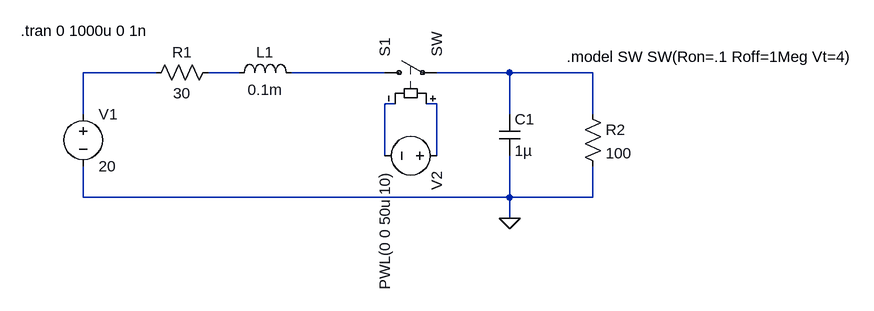
[diagram p0: schematic Draft2.asc]
Draft2.asc, the LTspice schematic file:
Version 4
SHEET 1 1232 680
WIRE 48 48 -64 48
WIRE 176 48 128 48
WIRE 400 48 256 48
WIRE 592 48 480 48
WIRE 720 48 592 48
WIRE 416 96 400 96
WIRE 480 96 464 96
WIRE -64 112 -64 48
WIRE 592 112 592 48
WIRE 720 112 720 48
WIRE 400 176 400 96
WIRE 480 176 480 96
WIRE -64 240 -64 192
WIRE 592 240 592 176
WIRE 592 240 -64 240
WIRE 720 240 720 192
WIRE 720 240 592 240
WIRE 592 272 592 240
FLAG 592 272 0
SYMBOL cap 576 112 R0
SYMATTR InstName C1
SYMATTR Value 1µ
SYMBOL ind 160 64 R270
WINDOW 0 32 56 VTop 2
WINDOW 3 5 56 VBottom 2
SYMATTR InstName L1
SYMATTR Value 0.1m
SYMBOL res 144 32 R90
WINDOW 0 0 56 VBottom 2
WINDOW 3 32 56 VTop 2
SYMATTR InstName R1
SYMATTR Value 30
SYMBOL voltage -64 96 R0
WINDOW 123 0 0 Left 0
WINDOW 39 0 0 Left 0
SYMATTR InstName V1
SYMATTR Value 20
SYMBOL sw 384 48 R270
SYMATTR InstName S1
SYMBOL voltage 496 176 R90
WINDOW 123 0 0 Left 0
WINDOW 39 0 0 Left 0
SYMATTR InstName V2
SYMATTR Value PWL(0 0 50u 10)
SYMBOL res 704 96 R0
SYMATTR InstName R2
SYMATTR Value 100
TEXT -160 -16 Left 2 !.tran 0 1000u 0 1n
TEXT 680 24 Left 2 !.model SW SW(Ron=.1 Roff=1Meg Vt=4)

The netlist it stands for:
* Draft2.asc
C1 N004 0 1µ
L1 N002 N003 0.1m
R1 N002 N001 30
V1 N001 0 20
S1 N003 N004 N006 N005 SW
V2 N006 N005 PWL(0 0 50u 10)
R2 N004 0 100
.tran 0 1000u 0 1n
.model SW SW(Ron=.1 Roff=1Meg Vt=4)
.backanno
.end